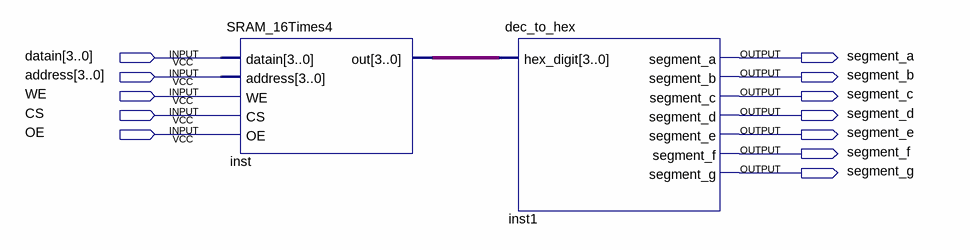
[diagram p0: schematic sheet]
// Quartus schematic SRAM_FINAL.bdf as structural Verilog: 2 symbols, 12 pins
module SRAM_FINAL (
  input  [3:0] datain,
  input  [3:0] address,
  input  WE,
  input  CS,
  input  OE,
  output segment_a,
  output segment_b,
  output segment_c,
  output segment_d,
  output segment_e,
  output segment_f,
  output segment_g
);

  wire [3:0] inst_out;

  SRAM_16Times4 inst (.datain(datain), .address(address), .WE(WE), .CS(CS), .OE(OE), .out(inst_out));
  dec_to_hex inst1 (
    .hex_digit(inst_out), .segment_a(segment_a), .segment_b(segment_b), .segment_c(segment_c),
    .segment_d(segment_d), .segment_e(segment_e), .segment_f(segment_f), .segment_g(segment_g));
endmodule
